# Altium schematic sheet MIDI.SchDoc
size A4; SheetNumber: 3; SheetTotal: 6
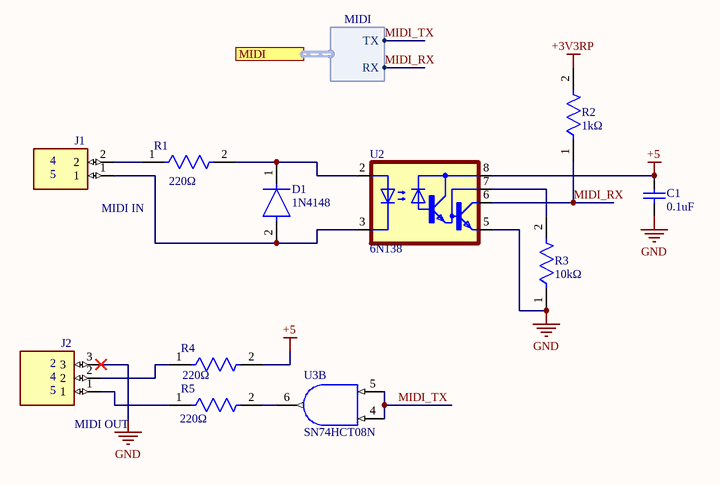
[diagram p0: MIDI.SchDoc]

## Parts
C1  0.1uF  [CAPR51-254-508X318X736]
D1  1N4148  [FP-017AG-MFG]
J1  MIDI IN  [SHDR2W100P0X500_1X2_1000X760X1]
J2  MIDI OUT  [39543-0603]
R1  Resistance: 220Ω  [FP-CMF50-0]  (hidden comment: CMF5073K200FHEB)
R2  Resistance: 1kΩ  [FP-CMF50-0]  (hidden comment: CMF5073K200FHEB)
R3  Resistance: 10kΩ  [FP-CMF50-0]  (hidden comment: CMF5073K200FHEB)
R4  Resistance: 220Ω  [FP-CMF50-0]  (hidden comment: CMF5073K200FHEB)
R5  Resistance: 220Ω  [FP-CMF50-0]  (hidden comment: CMF5073K200FHEB)
U2  6N138  [DIP762W50P254L1018H450Q8]
U3  SN74HCT08N  [N0014A]  (part B of 5)

## Ports
MIDI (harness MIDI, see Main[2C], MCU[1C])

## Harnesses
MIDI: TX, RX

## Nets
+3V3RP: R2.2
+5: C1.2 R4.2 U2.8(VCC)
GND: C1.1 J2.3 R3.1 U2.5(GND)
MIDI_RX: R2.1 U2.6(VO) ; port MIDI.RX
MIDI_TX: U3.4(2A) U3.5(2B) ; port MIDI.TX
NetD1_1: D1.1(C) R1.2 U2.2(A)
NetD1_2: D1.2(A) J1.1 U2.3(C)
NetJ1_2: J1.2 R1.1
NetJ2_1: J2.1 R5.1
NetJ2_2: J2.2 R4.1
NetR3_2: R3.2 U2.7(VB)
NetR5_2: R5.2 U3.6(2Y)

## Notes on the sheet
- (near J1) 4
- (near J1) 5
- (near J2) 4
- (near J2) 5
- (near J2) 2

## Library data of the parts
C1 = CMP-1664-00004-1: Radial Leaded Multilayer Ceramic Capacitor, 0.1 uF, +/- 10%, 50 V, -55 to 125 degC, 2-Pin THD, RoHS, Tape and Reel; Case\Package: SOT-23-5; Max Power Dissipation: 250 mW; Output Current: 150 mA; Dropout Voltage: 260 mV; Outputs: 1; Output Voltage: 5 V; Max Input Voltage: 8 V; Min Operating Temperature: -40 degC; Packaging: Tape and Reel; Height: 1.3 mm; Radiation Hardening: No; Pins: 5; ComponentLink1Description: Manufacturer URL; Mount: Surface Mount; RoHSCompliant: true; Max Operating Temperature: 85 degC; PackageReference: CAPR51-254-508X318X736; ComponentLink2URL: http://www.kemet.com/docfinder?Partnumber=C320C104K5R5TA; PackageDescription: 2-Pin Through Hole Device, Body 5.08 x 3.18 mm, Pitch 2.54 mm; ComponentLink1URL: http://www.kemet.com/; Width: 1.8 mm; Package Quantity: 3000; DatasheetVersion: Dec-15; Length: 3 mm; ComponentLink2Description: Datasheet
D1 = CMP-07163-000046-1: DIODE GEN PURP 100V 200MA DO35; Forward Voltage: 1V; Max Power Dissipation: 500mW; Max Reverse Current: 5uA; Forward Current: 300mA; Current: 4A; Reverse Recovery Time: 4ns; Element Configuration: Single; Outside Diameter: 1.85mm; Capacitance: 4pF; Polarity: Standard; Max Forward Surge Current (Ifsm): 1A; Reverse Voltage: 100V; Output Current: 200mA; Average Rectified Current: 200mA; Diameter: 1.91mm; Max Repetitive Reverse Voltage (Vrrm): 100V; Current Rating: 200mA; Case/Package: DO-35; Lead Free: Lead Free; Number of Pins: 2; Recovery Time: 4ns; Packaging: Bulk; Contact Plating: Tin; Voltage: 100V; Mount: Through Hole; Max Surge Current: 4A; Package Quantity: 2000; Width: 1.91mm; Max Reverse Voltage (DC): 100V; Length: 4.56mm; Radiation Hardening: No; Power Dissipation: 500mW; Voltage Rating (DC): 100V; Peak Non-Repetitive Surge Current: 4A; REACH SVHC: No SVHC; Height: 4.56mm; Max Operating Temperature: 175°C; Series: -; Weight: 0.01lb; Min Operating Temperature: -65°C
J1 = 39543-0602: 2 Position Wire to Board Terminal Block Horizontal with Board 0.197 (5.00mm) Through Hole; MF: Molex; MP: 395430602; Check_prices: https://www.snapeda.com/parts/395430602/Molex/view-part/?ref=eda; SnapEDA_Link: https://www.snapeda.com/parts/395430602/Molex/view-part/?ref=snap; Value: *; Package: None
J2 = 39543-0603: 3 Position Wire to Board Terminal Block Horizontal with Board 0.197 (5.00mm) Through Hole; MF: Molex; MP: 395430603; SnapEDA_Link: https://www.snapeda.com/parts/395430603/Molex/view-part/?ref=snap; Package: None; Value: *; Check_prices: https://www.snapeda.com/parts/395430603/Molex/view-part/?ref=eda
R1-R5 = CMP-00030-44386654-1: CMF5073K200FHEB Res Metal Film 73.2K Ohm 1% 0.125W(1/8W) ±50ppm/°C Epoxy AXL T/R; Voltage Rating: 200V; Power Rating: 125mW; Max Power Dissipation: 250mW; Number of Terminations: 2; Features: Flame Retardant Coating, Moisture Resistant; Termination: Axial; Diameter: 1.65mm; Packaging: Cut Tape; Min Operating Temperature: -55°C; Length: 3.81mm; Schedule B: 8533210090, 8533210090; Temperature Coefficient: 50ppm/°C; Tolerance: 1%; RoHS: Compliant; Voltage Rating (DC): 200V; Width: 1.65mm; Case/Package: Axial; Composition: Metal Film; Max Operating Temperature: 175°C; NexarPartId: 44386654; Lead Free: Lead Free; Mount: Through Hole
U2 = 6N138: ATT.NUM.P_TOT: 100 mW; Enclosure type (semiconductors): DIP 8; Forward current I(F): 20 mA; Forward voltage U(F): 1.1 V; Forward voltage U(F) typ.: 1.1 V; Insulation voltage: 5000 V RMS; Manufacturer: Lite-On; Manufacturer code (components): LTO; Mounting; MF: Isocom Components; SnapEDA_Link: https://www.snapeda.com/parts/6N138/Isocom/view-part/?ref=snap; Package: DIP-8 Lite-On; Value: *; MP: 6N138; Check_prices: https://www.snapeda.com/parts/6N138/Isocom/view-part/?ref=eda
U3 = CMP-0777-00257-3: Quadruple 2-Input Positive-AND Gates, N0014A, TUBE; Manufacturer: Texas Instruments; VCC(Max)(V): 5.5; Technology Family: HCT; tpd @ Nom Voltage(Max)(ns): 27; F @ Nom Voltage(Max)(Mhz): 25; ICC @ Nom Voltage(Max)(mA): 0.02; Rating: Catalog; Output Drive (IOL/IOH)(Max)(mA): -5.2/5.2; Output Type: CMOS; Input Type: TTL; Voltage(Nom)(V): 5; Schmitt Trigger: Yes; VCC(Min)(V): 4.5; Bits(#): 4; Generic Part Number: SN74HCT08; DatasheetVersion: SCLS063D; Operating Temperature Range(C): -40 to 85; PackageReference: N0014A